# EAGLE design ESP-03 to AVR ISP (EAGLE 7.2.0)
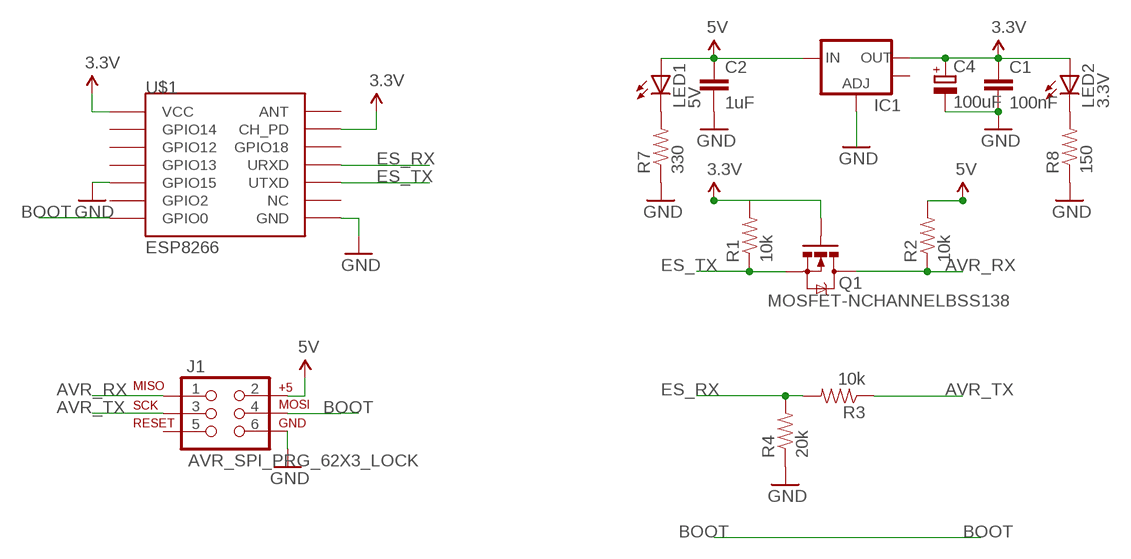
[diagram p0: schematic, sheet 1]

## Parts
C1  100nF  CAP0603-CAP  [0603-CAP]
C2  1uF  CAP0603-CAP  [0603-CAP]
C4  100uF  CPOL-EUB/3528-21R  [B/3528-21R]
IC1  V_REG_LM1117SOT223  [SOT223]
J1  AVR_SPI_PRG_62X3_LOCK  [2X3_LOCK]
LED1  5V  LED0603  [LED-0603]
LED2  3.3V  LED0603  [LED-0603]
Q1  MOSFET-NCHANNELBSS138  [SOT23-3]
R1  10k  RESISTOR0603-RES  [0603-RES]
R2  10k  RESISTOR0603-RES  [0603-RES]
R3  10k  RESISTOR0603-RES  [0603-RES]
R4  20k  RESISTOR0603-RES  [0603-RES]
R7  330  RESISTOR0603  [0603-RES]
R8  150  RESISTOR0603  [0603-RES]
U$1  ESP8266  [ESP-03]

## Nets
3.3V: C1.1 C4.+ IC1.2(OUT) LED2.A Q1.1(G) R1.2 U$1.CH_PD U$1.VCC
5V: C2.1 IC1.3(IN) J1.2 LED1.A R2.2
AVR_RX: J1.1 Q1.3(D) R2.1
AVR_TX: J1.3 R3.1
BOOT: J1.4 U$1.GPIO0
ES_RX: R3.2 R4.2 U$1.URXD
ES_TX: Q1.2(S) R1.1 U$1.UTXD
GND: C1.2 C2.2 C4.- IC1.1(ADJ) J1.6 R4.1 R7.1 R8.1 U$1.GND U$1.GPIO15
N$1: LED1.C R7.2
N$2: LED2.C R8.2
Unconnected: IC1.4(OUT) J1.5 U$1.ANT U$1.GPIO2 U$1.GPIO12 U$1.GPIO13 U$1.GPIO14 U$1.GPIO18 U$1.NC

## Library data of the parts
C1 C2 = SparkFun-Capacitors:CAP: Capacitor Standard 0603 ceramic capacitor, and 0.1" leaded capacitor.
C4 = rcl:CPOL-EU: POLARIZED CAPACITOR, European symbol
IC1 = SparkFun-PowerIC:V_REG_LM1117: Voltage Regulator LM1117 Standard adjustable voltage regulator but in SMD form. Spark Fun Electronics SKU : COM-00595
J1 = SparkFun-Connectors:AVR_SPI_PRG_6: AVR ISP 6 Pin This is the reduced ISP connector for AVR programming. Common on Arduino. This footprint will take up less PCB space and can be used with a 10-pin to 6-pin adapter such as SKU: BOB-08508
LED1 LED2 = SparkFun-LED:LED: LEDs Standard schematic elements and footprints for 5mm, 3mm, 1206, and 0603 sized LEDs. 5mm - Spark Fun Electronics SKU : COM-00529 (and others)
Q1 = SparkFun-DiscreteSemi:MOSFET-NCHANNEL: Common NMOSFET Parts MFG P/N Store ID Prod ID FDD8780 TRANS-09984 SI7820DN TRANS-11055 FDS6630A IC-08089 2N7002PW TRANS-11151 FQP30N06L COM-10213 TRANS-10060 BSS123LT1G TRANS-08345 BSS138 TRANS-00830 BS170 2N7000; PROD_ID: TRANS-00830
R1-R4 R7 R8 = SparkFun-Resistors:RESISTOR: Resistor Basic schematic elements and footprints for 0603, 1206, and PTH resistors.
U$1 = esp8266modules:ESP8266: ESP8266 Wifi module 03 & 04

## Board
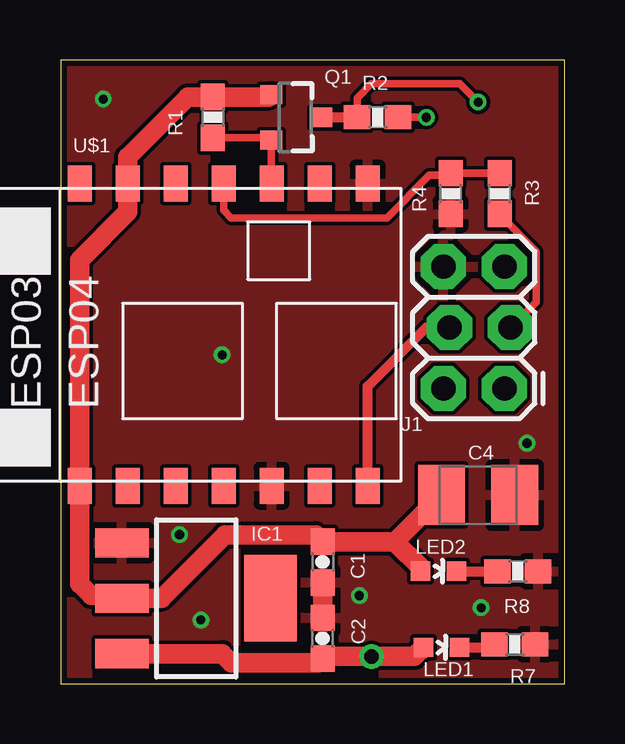
[diagram p1: board, top side]
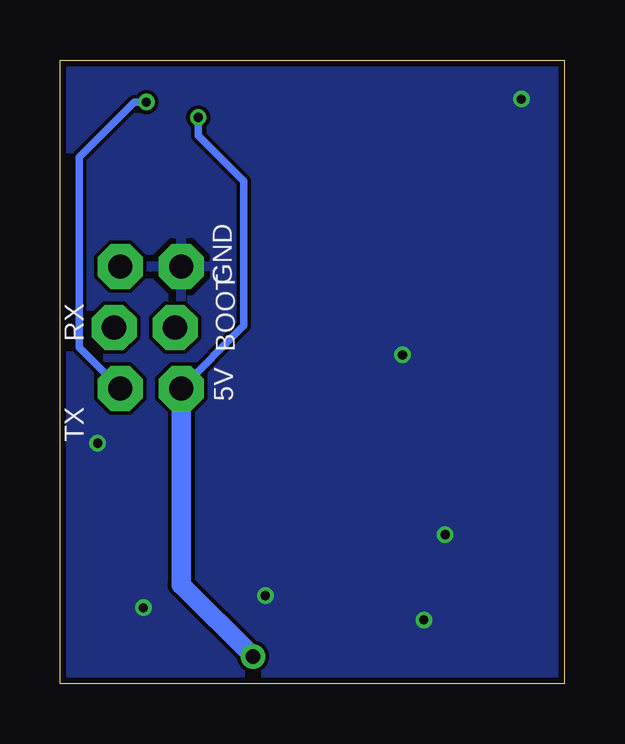
[diagram p2: board, bottom side, seen from below]

Size 21 x 26 mm. Coordinates in mm from the lower left corner, seen from the top.
Outline: 0,0 21,0 21,26 0,26 0,0
Copper layers (1*16): Top 0.035mm / dielectric 1.5mm / Bottom 0.035mm
Design rules "SeeedStudio_2layer_DRU_no_angle_20140221": minimum track width 6mil, minimum drill 12mil, track to track 6mil, track to pad 6mil, pad to pad 6mil, via to via 6mil, smd to smd 0mil, copper to edge 10mil, drill to drill 10mil, minimum pad ring 10mil, minimum via ring 6mil, stop-mask expansion 2mil, vias tented up to drill 100mil, thermal gap 10mil

### Footprints (pad centres in the part's own frame; a part is rotated, then mirrored left to right if it is on the bottom)
0603-CAP = smd 1.1 x 1: 1 -0.85,0; 2 0.85,0
B/3528-21R = smd 1.95 x 2.5: + 1.525,0; - -1.525,0
SOT223 = smd 1.219 x 2.235: 1 -2.311,-3.099; 2 0,-3.099; 3 2.311,-3.099 | smd 3.6 x 2.2: 4 0,3.099
2X3_LOCK = drill 1.016 pad 1.88 octagon: 1 0,0; 2 0,2.54; 3 2.54,-0.254; 4 2.54,2.286; 5 5.08,0; 6 5.08,2.54
LED-0603 = smd 0.8 x 0.8: A 0,-0.75; C 0,0.75
SOT23-3 = smd 0.8 x 0.9: 1 -0.95,-1; 2 0.95,-1; 3 0,1.1
0603-RES = smd 1.1 x 1: 1 -0.85,0; 2 0.85,0
ESP-03 = smd 1.5 x 1: ANT 7.4,4.8; CH_PD 7.4,2.8; GND 7.4,-7.2; GPIO0 -5.2,-7.2; GPIO2 -5.2,-5.2; GPIO12 -5.2,0.8; GPIO13 -5.2,-1.2; GPIO14 -5.2,2.8; GPIO15 -5.2,-3.2; GPIO18 7.4,0.8; NC 7.4,-5.2; URXD 7.4,-1.2; UTXD 7.4,-3.2; VCC -5.2,4.8

### Placement (x,y rotation side)
C1  10.92,5.06 270 top
C2  10.92,1.89 90 top
C4  17.4,7.86 180 top
IC1  5.65,3.56 270 top
J1  18.49,12.3 90 top
LED1  15.88,1.51 270 top
LED2  15.75,4.68 270 top
Q1  9.78,23.61 270 top
R1  6.35,23.61 90 top
R2  13.21,23.61 0 top
R3  18.29,20.43 90 top
R4  16.26,20.43 90 top
R7  18.92,1.64 180 top
R8  19.05,4.68 180 top
U$1  5.59,13.45 90 top

### Tracks (layer width: path | path; a pad name or v marks a point on that pad's centre or on a via)
3.3V
  Top 0.813: Q1.1 8.68,24.46 R1.2 5.29,24.46 2.79,21.96 U$1.CH_PD 2.79,19.67 0.79,17.66 U$1.VCC 0.79,4.15 1.27,3.67 2.44,3.67 IC1.2 4.21,3.56 6.86,6.21 10.63,6.21 C1.1 | 14.99,4.68 LED2.A 15,4.85 13.93,5.91 | C1.1 10.92,5.95 | C1.1 13.93,5.91 | 13.93,5.91 C4.+
5V  (via drill 0.38, 0.6 pad 1.02)
  Top 0.305: R2.2 v15.24,23.61
  Top 0.813: 10.86,1.1 C2.1 | C2.1 11.01,1.13 v12.95,1.13 14.74,1.13 LED1.A | IC1.3 6.74,1.24 7.11,0.87 10.76,0.87 C2.1
  Bottom 0.305: v15.24,23.61 15.24,22.84 13.34,20.94 13.34,14.92 J1.2
  Bottom 0.813: J1.2 15.95,4.12 v12.95,1.13
AVR_RX  (via drill 0.38)
  Top 0.305: R2.1 12.36,24.41 12.95,25 16.64,25 v17.4,24.24
  Top 0.406: Q1.3 R2.1
  Bottom 0.305: v17.4,24.24 17.91,24.24 20.19,21.96 20.19,14.01 J1.1
AVR_TX
  Top 0.305: R3.1 18.29,19.54 19.81,18.02 19.81,15.91 J1.3
BOOT
  Top 0.406: U$1.GPIO0 12.79,12.39 15.24,14.84 J1.4
ES_RX
  Top 0.305: U$1.URXD 6.79,19.74 7.11,19.42 13.59,19.42 15.37,21.19 16.17,21.19 R4.2 R3.2
ES_TX
  Top 0.305: R1.1 8.68,22.76 Q1.2 U$1.UTXD
GND  (via drill 0.38)
  Top 0.813: C1.2 C2.2
  other vias: 19.43,10.02 5.84,2.65 1.78,24.37 6.73,13.7 4.95,6.21 17.53,3.16 12.45,3.67
  pour Bottom: 0,0 21,0 21,26 0,26
  pour Top: 0,26 21,26 21,0 0,0
N$1
  Top 0.406: LED1.C 17.95,1.51 R7.2
N$2
  Top 0.406: LED2.C R8.2

### Text on the board
bPlace: RX | TX
bNames: GND | BOOT | 5V